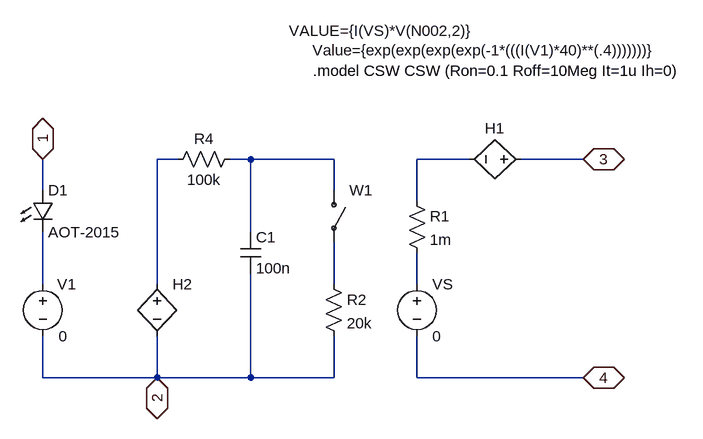
[diagram p0: schematic ZX1.asc]
ZX1.asc, the LTspice schematic file:
Version 4
SHEET 1 880 680
WIRE 144 -32 112 -32
WIRE 256 -32 224 -32
WIRE 384 -32 256 -32
WIRE 592 -32 512 -32
WIRE 768 -32 672 -32
WIRE -64 16 -64 -32
WIRE 384 16 384 -32
WIRE 512 32 512 -32
WIRE 256 80 256 -32
WIRE -64 160 -64 80
WIRE 112 160 112 -32
WIRE 384 160 384 96
WIRE 512 160 512 112
WIRE -64 304 -64 240
WIRE 112 304 112 240
WIRE 112 304 -64 304
WIRE 256 304 256 144
WIRE 256 304 112 304
WIRE 384 304 384 240
WIRE 384 304 256 304
WIRE 512 304 512 240
WIRE 768 304 512 304
FLAG -64 -32 1
IOPIN -64 -32 BiDir
FLAG 768 -32 3
IOPIN 768 -32 BiDir
FLAG 112 304 2
IOPIN 112 304 BiDir
FLAG 768 304 4
IOPIN 768 304 BiDir
SYMBOL LED -80 16 R0
SYMATTR InstName D1
SYMATTR Value AOT-2015
SYMATTR Description Diode
SYMATTR Type diode
SYMBOL voltage 512 144 R0
SYMATTR InstName VS
SYMATTR Value 0
SYMBOL res 496 16 R0
SYMATTR InstName R1
SYMATTR Value 1m
SYMBOL voltage -64 144 R0
WINDOW 0 37 16 Center 2
SYMATTR InstName V1
SYMATTR Value 0
SYMBOL cap 240 80 R0
SYMATTR InstName C1
SYMATTR Value 100n
SYMBOL res 368 144 R0
SYMATTR InstName R2
SYMATTR Value 20k
SYMBOL res 240 -48 R90
WINDOW 0 0 56 VBottom 2
WINDOW 3 32 56 VTop 2
SYMATTR InstName R4
SYMATTR Value 100k
SYMBOL csw 384 16 R0
WINDOW 3 24 28 Invisible 2
SYMATTR Value VS CSW
SYMATTR InstName W1
SYMBOL h 688 -32 R90
WINDOW 0 -32 56 VBottom 2
WINDOW 3 -213 232 VTop 2
SYMATTR InstName H1
SYMATTR Value VALUE={I(VS)*V(N002,2)}
SYMBOL h 112 144 R0
WINDOW 3 239 -344 Left 2
SYMATTR Value Value={exp(exp(exp(exp(-1*(((I(V1)*40)**(.4)))))))}
SYMATTR InstName H2
TEXT 352 -168 Left 2 !.model CSW CSW (Ron=0.1 Roff=10Meg It=1u Ih=0)

The netlist it stands for:
* ZX1.asc
D1 1 N004 AOT-2015
VS N006 4 0
R1 N003 N006 1m
V1 N004 2 0
C1 N002 2 100n
R2 N005 2 20k
R4 N002 N001 100k
W1 N002 N005 VS CSW
H1 3 N003 VALUE={I(VS)*V(N002,2)}
H2 N001 2 Value={exp(exp(exp(exp(-1*(((I(V1)*40)**(.4)))))))}
.model D D
.lib standard.dio
.model CSW CSW (Ron=0.1 Roff=10Meg It=1u Ih=0)
.backanno
.end